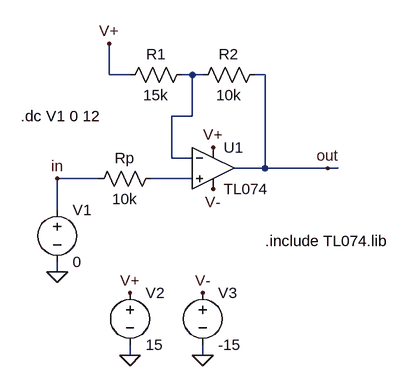
[diagram p0: schematic Level_shifter_DC.asc]
Level_shifter_DC.asc, the LTspice schematic file:
Version 4
SHEET 1 880 680
WIRE 48 16 48 -32
WIRE 80 16 48 16
WIRE 176 16 160 16
WIRE 192 16 176 16
WIRE 288 16 272 16
WIRE 176 80 176 16
WIRE 176 80 144 80
WIRE 144 144 144 80
WIRE 176 144 144 144
WIRE 288 160 288 16
WIRE 288 160 240 160
WIRE 384 160 288 160
WIRE 400 160 384 160
WIRE 32 176 -32 176
WIRE 176 176 112 176
WIRE -32 224 -32 176
WIRE -32 320 -32 304
WIRE 80 448 80 432
WIRE 192 448 192 432
FLAG 192 448 0
FLAG 80 448 0
FLAG -32 320 0
FLAG 80 352 V+
FLAG 208 128 V+
FLAG 192 352 V-
FLAG 208 192 V-
FLAG -32 176 in
FLAG 384 160 out
FLAG 48 -32 V+
SYMBOL Opamps\\opamp2 208 96 R0
SYMATTR InstName U1
SYMATTR Value TL074
SYMBOL res 16 192 R270
WINDOW 0 32 56 VTop 0
WINDOW 3 0 56 VBottom 0
SYMATTR InstName Rp
SYMATTR Value 10k
SYMBOL res 64 32 R270
WINDOW 0 32 56 VTop 0
WINDOW 3 0 56 VBottom 0
SYMATTR InstName R1
SYMATTR Value 15k
SYMBOL res 176 32 R270
WINDOW 0 32 56 VTop 0
WINDOW 3 0 56 VBottom 0
SYMATTR InstName R2
SYMATTR Value 10k
SYMBOL voltage -32 208 R0
SYMATTR InstName V1
SYMATTR Value 0
SYMBOL voltage 80 336 R0
SYMATTR InstName V2
SYMATTR Value 15
SYMBOL voltage 192 336 R0
SYMATTR InstName V3
SYMATTR Value -15
TEXT 288 272 Left 0 !.include TL074.lib
TEXT -88 80 Left 0 !.dc V1 0 12

The netlist it stands for:
* Level_shifter_DC.asc
XU1 N002 N001 V+ V- out TL074  ; pins In+ In- V+ V- OUT
Rp in N002 10k
R1 V+ N001 15k
R2 N001 out 10k
V1 in 0 0
V2 V+ 0 15
V3 V- 0 -15
.include TL074.lib
.dc V1 0 12
.backanno
.end